# EAGLE schematic comms_robot (EAGLE 9.6.2)
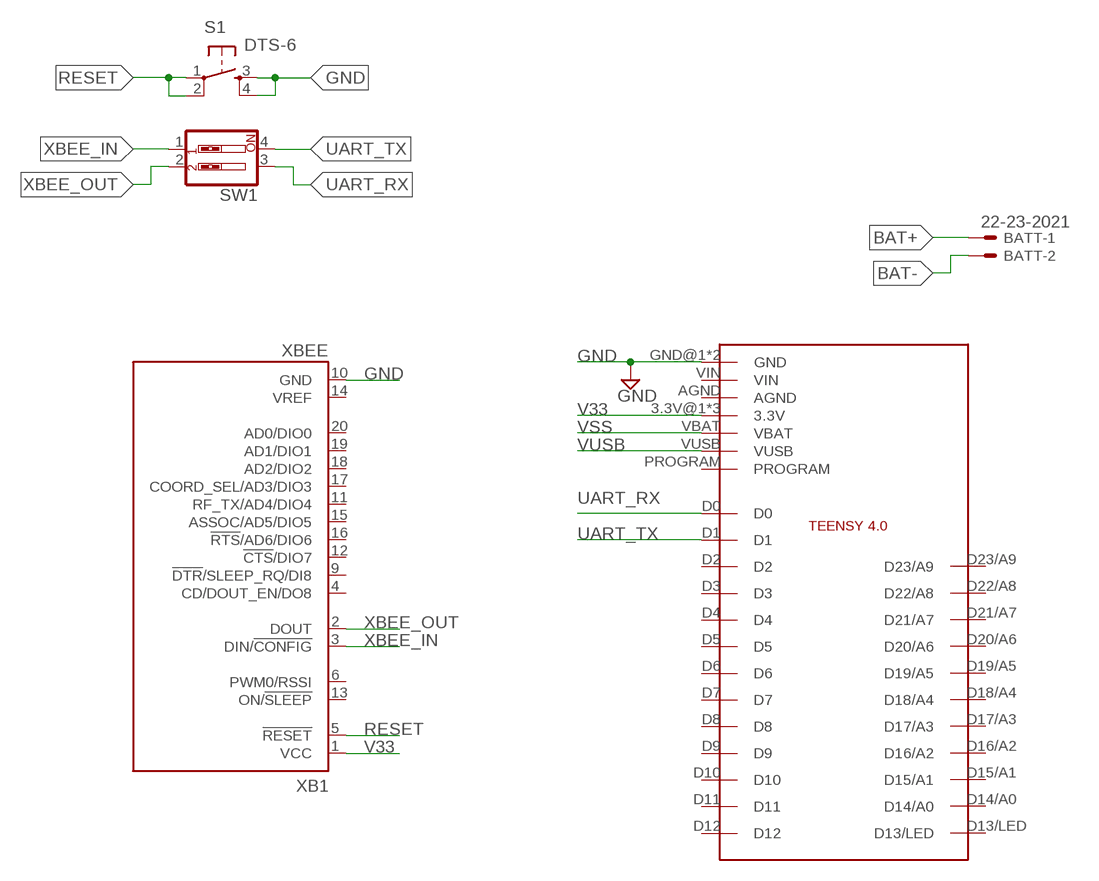
[diagram p0: schematic, sheet 1]

## Parts
BATT  22-23-2021  [22-23-2021]
S1  DTS-6  [DTS-6]
SW1  SW_DIP-2  [EDG-02]
U$1  TEENSY4.0  [TEENSY4.0]
XB1  XBEE  [XBEE]

## Nets
BAT+: BATT.1
BAT-: BATT.2
GND: S1.3 S1.4 U$1.GND@1(GND) U$1.GND@2(GND) XB1.10(GND)
RESET: S1.1 S1.2 XB1.5(!RESET)
UART_RX: SW1.3 U$1.D0
UART_TX: SW1.4 U$1.D1
V33: U$1.3.3V@1(3.3V) U$1.3.3V@2(3.3V) U$1.ON/OFF(3.3V) XB1.1(VCC)
VSS: U$1.VBAT
VUSB: U$1.VUSB
XBEE_IN: SW1.1 XB1.3(DIN/!CONFIG)
XBEE_OUT: SW1.2 XB1.2(DOUT)
Unconnected: U$1.AGND U$1.D2 U$1.D3 U$1.D4 U$1.D5 U$1.D6 U$1.D7 U$1.D8 U$1.D9 U$1.D10 U$1.D11 U$1.D12 U$1.D13/LED U$1.D14/A0 U$1.D15/A1 U$1.D16/A2 U$1.D17/A3 U$1.D18/A4 U$1.D19/A5 U$1.D20/A6 U$1.D21/A7 U$1.D22/A8 U$1.D23/A9 U$1.PROGRAM U$1.VIN XB1.4(CD/DOUT_EN/DO8) XB1.6(PWM0/RSSI) XB1.9(!DTR!/SLEEP_RQ/DI8) XB1.11(RF_TX/AD4/DIO4) XB1.12(!CTS!/DIO7) XB1.13(ON/!SLEEP) XB1.14(VREF) XB1.15(ASSOC/AD5/DIO5) XB1.16(!RTS!/AD6/DIO6) XB1.17(COORD_SEL/AD3/DIO3) XB1.18(AD2/DIO2) XB1.19(AD1/DIO1) XB1.20(AD0/DIO0)

## Library data of the parts
BATT = con-molex:22-23-2021: .100" (2.54mm) Center Header - 2 Pin; MF: MOLEX; MPN: 22-23-2021; OC_FARNELL: 1462926; OC_NEWARK: 25C3832
S1 = switch-tact:DTS-6
SW1 = special:SW_DIP-2: DIP SWITCH
U$1 = Teensy4.0:TEENSY4.0
XB1 = maxstream:XBEE: XBee (TM) /XBee-PRO(TM) OEM RF Modules Source: MaxStream, Inc. xbee_productmanual.pdf; MPN: XBP24-Z7UIT-004; OC_FARNELL: 1751799; OC_NEWARK: 34R5507